# EAGLE schematic Arm Board (EAGLE 6.5.0)

## Sheet 1 of 8
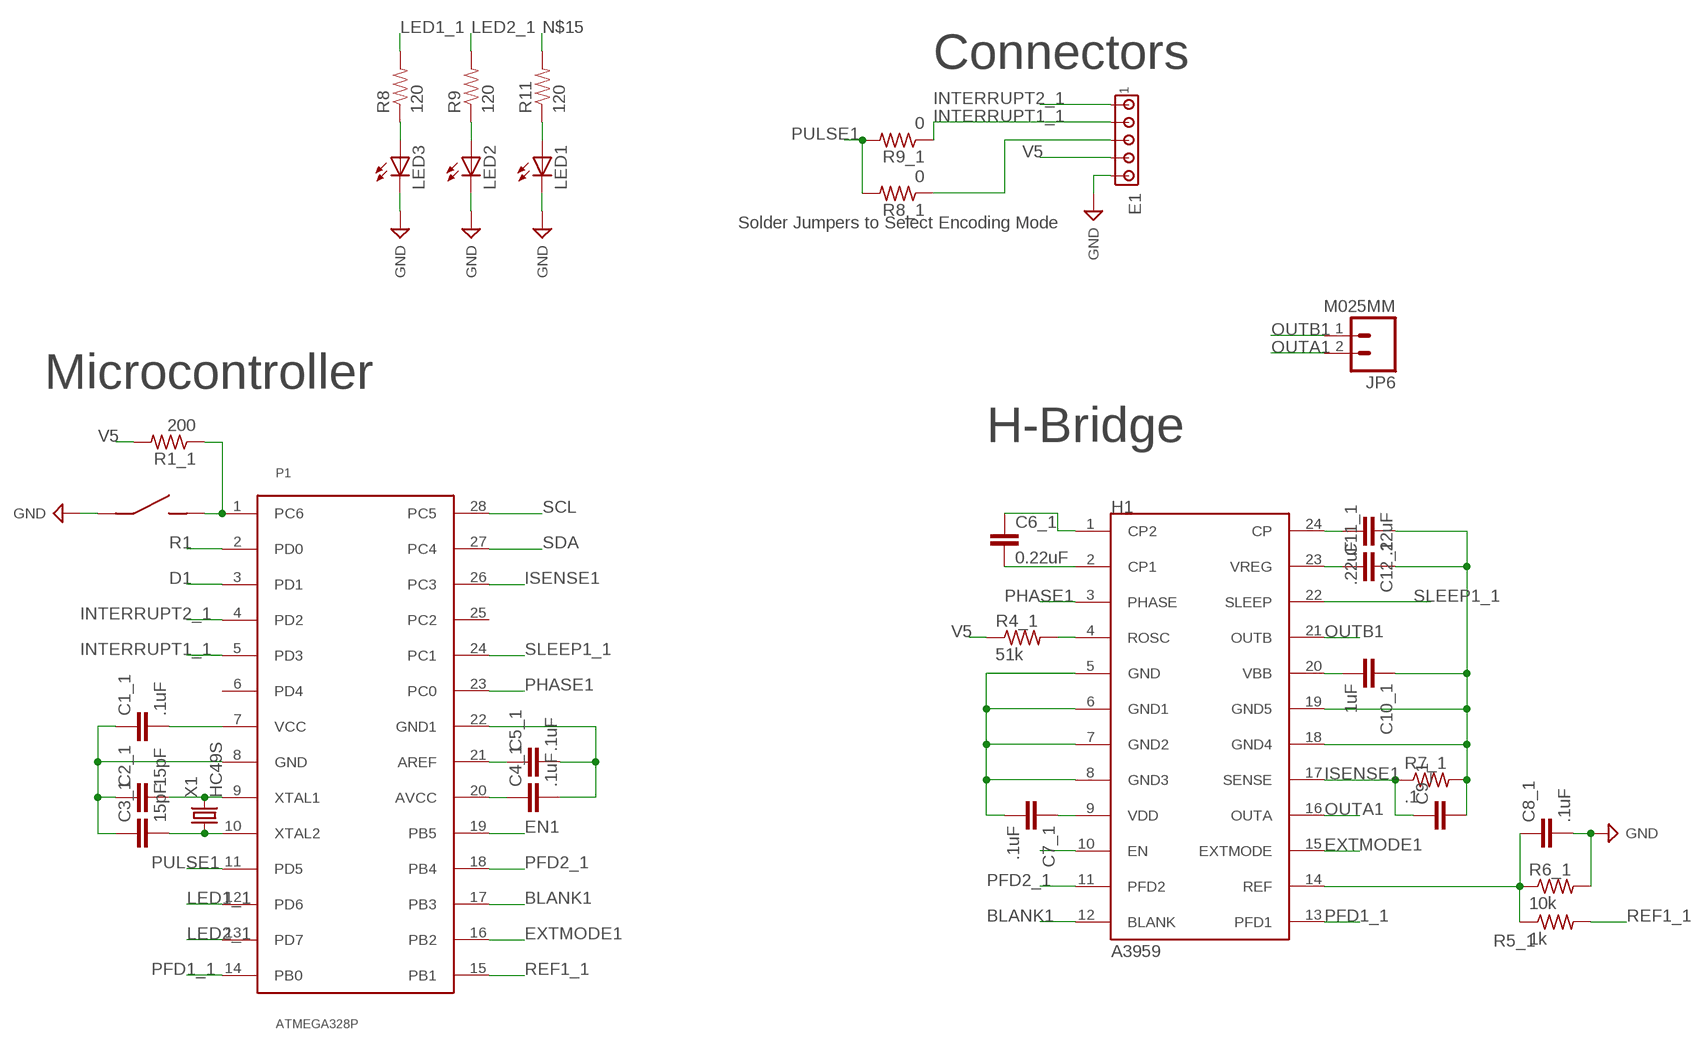
[diagram p0: schematic, sheet 1]

### Parts
C1_1  .1uF  C_CAP_0805  [C_0805]
C2_1  15pF  C_CAP_0805  [C_0805]
C3_1  15pF  C_CAP_0805  [C_0805]
C4_1  .1uF  C_CAP_0805  [C_0805]
C5_1  .1uF  C_CAP_0805  [C_0805]
C6_1  0.22uF  C_CAP_0805  [C_0805]
C7_1  .1uF  C_CAP_0805  [C_0805]
C8_1  .1uF  C_CAP_0805  [C_0805]
C9_1  C_CAP_0805  [C_0805]
C10_1  1uF  C_CAP_0805  [C_0805]
C11_1  .22uF  C_CAP_0805  [C_0805]
C12_1  .22uF  C_CAP_0805  [C_0805]
E1  J_MTA5P_100  [J_MTA100_5P]
H1  A3959  Q_A3959  [DIP24]
JP6  M025MM  [SCREWTERMINAL-5MM-2]
LED1  LED1206  [LED-1206]
LED2  LED1206  [LED-1206]
LED3  LED1206  [LED-1206]
P1  ATMEGA328P  Q_ATMEGA328P  [DIP28]
R1_1  200  R_RES_0805  [R_0805]
R4_1  51k  R_RES_0805  [R_0805]
R5_1  1k  R_RES_0805  [R_0805]
R6_1  10k  R_RES_0805  [R_0805]
R7_1  .1  R_RES_2010  [R_2010]
R8  120  RESISTOR1206  [1206]
R8_1  0  R_RES_0603  [R_0603]
R9  120  RESISTOR1206  [1206]
R9_1  0  R_RES_0603  [R_0603]
R11  120  RESISTOR1206  [1206]
S1  J_MC32857  [J_TOGGLE]
X1  HC49S  X_HC49SCRYSTAL  [HC-49]

### Nets
BLANK1: H1.12(BLANK) P1.17(PB3)
D1: P1.3(PD1)
EN1: H1.10(EN) P1.19(PB5)
EXTMODE1: H1.15(EXTMODE) P1.16(PB2)
GND: C1_1.1 C2_1.1 C3_1.1 C4_1.2 C5_1.2 C7_1.2 C8_1.2 C9_1.2 C10_1.1 C11_1.2 C12_1.1 E1.5 H1.5(GND) H1.6(GND1) H1.7(GND2) H1.8(GND3) H1.18(GND4) H1.19(GND5) LED1.C LED2.C LED3.C P1.8(GND) P1.22(GND1) R6_1.2 R7_1.2 S1.P$1 ; supply symbol labelled SUP_GND ; also sheet 2,3,4,5,6,7,8
INTERRUPT1_1: E1.2 P1.5(PD3) R9_1.1
INTERRUPT2_1: E1.1 P1.4(PD2)
ISENSE1: C9_1.1 H1.17(SENSE) P1.26(PC3) R7_1.1
LED1_1: P1.12(PD6) R8.2
LED2_1: P1.13(PD7) R9.2
N$3: LED3.A R8.1
N$4: LED2.A R9.1
N$6: LED1.A R11.1
N$11: C3_1.2 P1.10(XTAL2) X1.P$1
N$12: C2_1.2 P1.9(XTAL1) X1.P$2
N$14: C5_1.1 P1.21(AREF)
N$15: P1.1(PC6) R1_1.1 R11.2 S1.P$2
N$16: C6_1.1 H1.1(CP2)
N$17: C6_1.2 H1.2(CP1)
N$18: H1.4(ROSC) R4_1.2
N$20: C12_1.2 H1.24(CP)
N$22: C11_1.1 H1.23(VREG)
N$26: E1.3 R8_1.1
OUTA1: H1.16(OUTA) JP6.2
OUTB1: H1.21(OUTB) JP6.1
PFD1_1: H1.13(PFD1) P1.14(PB0)
PFD2_1: H1.11(PFD2) P1.18(PB4)
PHASE1: H1.3(PHASE) P1.23(PC0)
PULSE1: P1.11(PD5) R8_1.2 R9_1.2
R1: P1.2(PD0)
REF1: C8_1.1 H1.14(REF) R5_1.1 R6_1.1
REF1_1: P1.15(PB1) R5_1.2
SCL: P1.28(PC5) ; also sheet 2,3,4,5,6,7
SDA: P1.27(PC4) ; also sheet 2,3,4,5,6,7
SLEEP1_1: H1.22(SLEEP) P1.24(PC1)
V5: C1_1.2 C4_1.1 C7_1.1 E1.4 H1.9(VDD) P1.7(VCC) P1.20(AVCC) R1_1.2 R4_1.1 ; also sheet 2,3,4,5,6,7,8
VIN: C10_1.2 H1.20(VBB) ; also sheet 2,3,4,5,6,7,8
Unconnected: P1.6(PD4) P1.25(PC2)

### Notes on the sheet
- Connectors
- Solder Jumpers to Select Encoding Mode
- Microcontroller
- H-Bridge

## Sheet 2 of 8
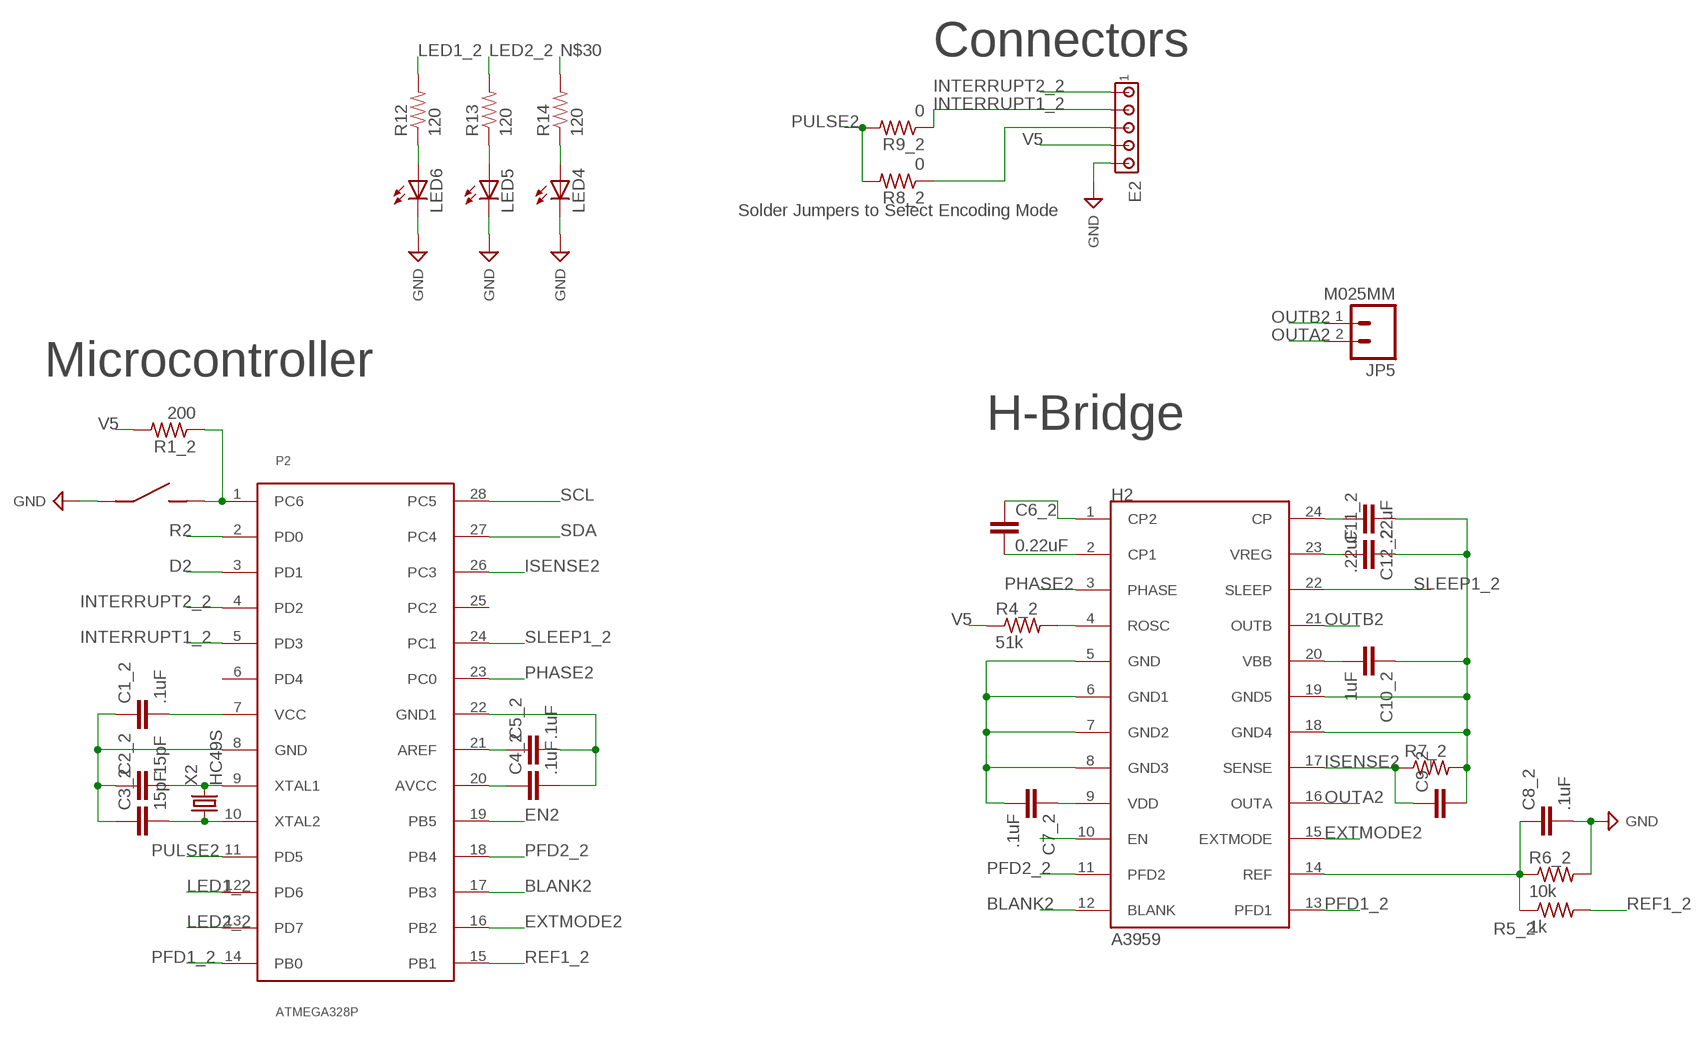
[diagram p1: schematic, sheet 2]

### Parts
C1_2  .1uF  C_CAP_0805  [C_0805]
C2_2  15pF  C_CAP_0805  [C_0805]
C3_2  15pF  C_CAP_0805  [C_0805]
C4_2  .1uF  C_CAP_0805  [C_0805]
C5_2  .1uF  C_CAP_0805  [C_0805]
C6_2  0.22uF  C_CAP_0805  [C_0805]
C7_2  .1uF  C_CAP_0805  [C_0805]
C8_2  .1uF  C_CAP_0805  [C_0805]
C9_2  C_CAP_0805  [C_0805]
C10_2  1uF  C_CAP_0805  [C_0805]
C11_2  .22uF  C_CAP_0805  [C_0805]
C12_2  .22uF  C_CAP_0805  [C_0805]
E2  J_MTA5P_100  [J_MTA100_5P]
H2  A3959  Q_A3959  [DIP24]
JP5  M025MM  [SCREWTERMINAL-5MM-2]
LED4  LED1206  [LED-1206]
LED5  LED1206  [LED-1206]
LED6  LED1206  [LED-1206]
P2  ATMEGA328P  Q_ATMEGA328P  [DIP28]
R1_2  200  R_RES_0805  [R_0805]
R4_2  51k  R_RES_0805  [R_0805]
R5_2  1k  R_RES_0805  [R_0805]
R6_2  10k  R_RES_0805  [R_0805]
R7_2  R_RES_2010  [R_2010]
R8_2  0  R_RES_0603  [R_0603]
R9_2  0  R_RES_0603  [R_0603]
R12  120  RESISTOR1206  [1206]
R13  120  RESISTOR1206  [1206]
R14  120  RESISTOR1206  [1206]
S2  J_MC32857  [J_TOGGLE]
X2  HC49S  X_HC49SCRYSTAL  [HC-49]

### Nets
BLANK2: H2.12(BLANK) P2.17(PB3)
D2: P2.3(PD1)
EN2: H2.10(EN) P2.19(PB5)
EXTMODE2: H2.15(EXTMODE) P2.16(PB2)
GND: C1_2.1 C2_2.1 C3_2.1 C4_2.2 C5_2.2 C7_2.2 C8_2.2 C9_2.2 C10_2.1 C11_2.2 C12_2.1 E2.5 H2.5(GND) H2.6(GND1) H2.7(GND2) H2.8(GND3) H2.18(GND4) H2.19(GND5) LED4.C LED5.C LED6.C P2.8(GND) P2.22(GND1) R6_2.2 R7_2.2 S2.P$1 ; supply symbol labelled SUP_GND ; also sheet 1,3,4,5,6,7,8
INTERRUPT1_2: E2.2 P2.5(PD3) R9_2.1
INTERRUPT2_2: E2.1 P2.4(PD2)
ISENSE2: C9_2.1 H2.17(SENSE) P2.26(PC3) R7_2.1
LED1_2: P2.12(PD6) R12.2
LED2_2: P2.13(PD7) R13.2
N$7: LED6.A R12.1
N$13: LED5.A R13.1
N$19: LED4.A R14.1
N$27: C3_2.2 P2.10(XTAL2) X2.P$1
N$28: C2_2.2 P2.9(XTAL1) X2.P$2
N$29: C5_2.1 P2.21(AREF)
N$30: P2.1(PC6) R1_2.1 R14.2 S2.P$2
N$31: C6_2.1 H2.1(CP2)
N$32: C6_2.2 H2.2(CP1)
N$33: H2.4(ROSC) R4_2.2
N$34: C12_2.2 H2.24(CP)
N$35: C11_2.1 H2.23(VREG)
N$39: E2.3 R8_2.1
OUTA2: H2.16(OUTA) JP5.2
OUTB2: H2.21(OUTB) JP5.1
PFD1_2: H2.13(PFD1) P2.14(PB0)
PFD2_2: H2.11(PFD2) P2.18(PB4)
PHASE2: H2.3(PHASE) P2.23(PC0)
PULSE2: P2.11(PD5) R8_2.2 R9_2.2
R2: P2.2(PD0)
REF1_2: P2.15(PB1) R5_2.2
REF2: C8_2.1 H2.14(REF) R5_2.1 R6_2.1
SCL: P2.28(PC5) ; also sheet 1,3,4,5,6,7
SDA: P2.27(PC4) ; also sheet 1,3,4,5,6,7
SLEEP1_2: H2.22(SLEEP) P2.24(PC1)
V5: C1_2.2 C4_2.1 C7_2.1 E2.4 H2.9(VDD) P2.7(VCC) P2.20(AVCC) R1_2.2 R4_2.1 ; also sheet 1,3,4,5,6,7,8
VIN: C10_2.2 H2.20(VBB) ; also sheet 1,3,4,5,6,7,8
Unconnected: P2.6(PD4) P2.25(PC2)

### Notes on the sheet
- Connectors
- Solder Jumpers to Select Encoding Mode
- Microcontroller
- H-Bridge

## Sheet 3 of 8
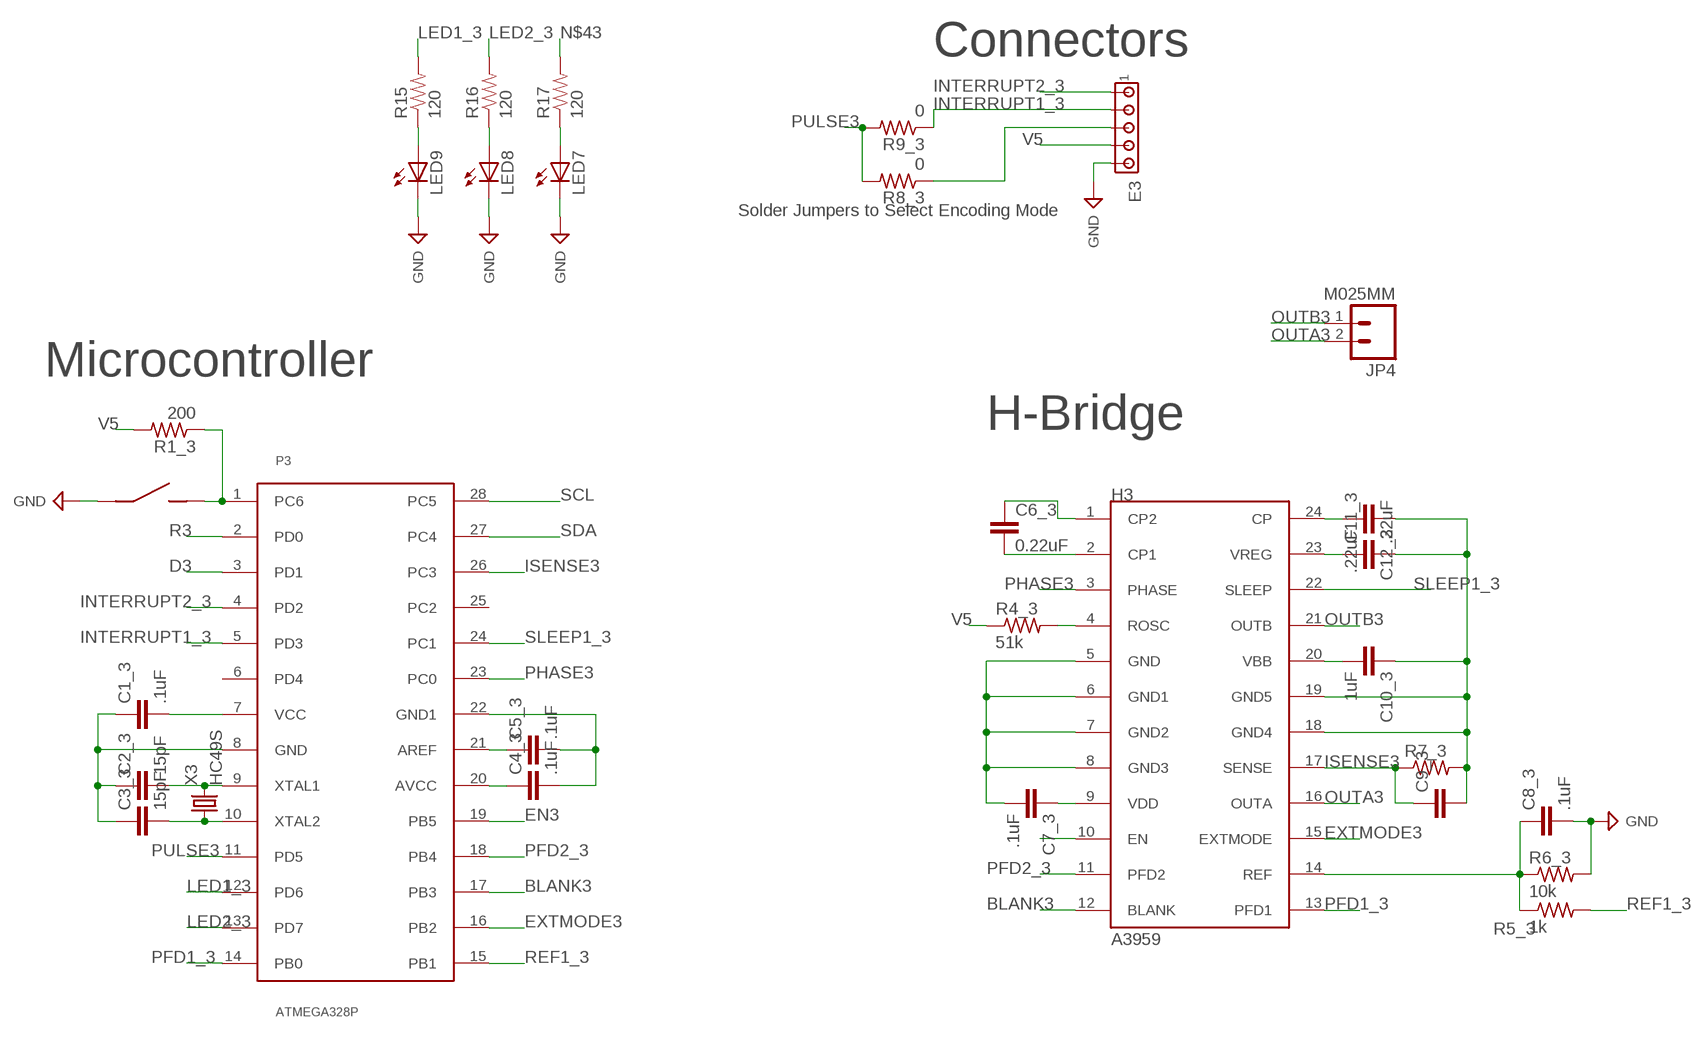
[diagram p2: schematic, sheet 3]

### Parts
C1_3  .1uF  C_CAP_0805  [C_0805]
C2_3  15pF  C_CAP_0805  [C_0805]
C3_3  15pF  C_CAP_0805  [C_0805]
C4_3  .1uF  C_CAP_0805  [C_0805]
C5_3  .1uF  C_CAP_0805  [C_0805]
C6_3  0.22uF  C_CAP_0805  [C_0805]
C7_3  .1uF  C_CAP_0805  [C_0805]
C8_3  .1uF  C_CAP_0805  [C_0805]
C9_3  C_CAP_0805  [C_0805]
C10_3  1uF  C_CAP_0805  [C_0805]
C11_3  .22uF  C_CAP_0805  [C_0805]
C12_3  .22uF  C_CAP_0805  [C_0805]
E3  J_MTA5P_100  [J_MTA100_5P]
H3  A3959  Q_A3959  [DIP24]
JP4  M025MM  [SCREWTERMINAL-5MM-2]
LED7  LED1206  [LED-1206]
LED8  LED1206  [LED-1206]
LED9  LED1206  [LED-1206]
P3  ATMEGA328P  Q_ATMEGA328P  [DIP28]
R1_3  200  R_RES_0805  [R_0805]
R4_3  51k  R_RES_0805  [R_0805]
R5_3  1k  R_RES_0805  [R_0805]
R6_3  10k  R_RES_0805  [R_0805]
R7_3  R_RES_2010  [R_2010]
R8_3  0  R_RES_0603  [R_0603]
R9_3  0  R_RES_0603  [R_0603]
R15  120  RESISTOR1206  [1206]
R16  120  RESISTOR1206  [1206]
R17  120  RESISTOR1206  [1206]
S3  J_MC32857  [J_TOGGLE]
X3  HC49S  X_HC49SCRYSTAL  [HC-49]

### Nets
BLANK3: H3.12(BLANK) P3.17(PB3)
D3: P3.3(PD1)
EN3: H3.10(EN) P3.19(PB5)
EXTMODE3: H3.15(EXTMODE) P3.16(PB2)
GND: C1_3.1 C2_3.1 C3_3.1 C4_3.2 C5_3.2 C7_3.2 C8_3.2 C9_3.2 C10_3.1 C11_3.2 C12_3.1 E3.5 H3.5(GND) H3.6(GND1) H3.7(GND2) H3.8(GND3) H3.18(GND4) H3.19(GND5) LED7.C LED8.C LED9.C P3.8(GND) P3.22(GND1) R6_3.2 R7_3.2 S3.P$1 ; supply symbol labelled SUP_GND ; also sheet 1,2,4,5,6,7,8
INTERRUPT1_3: E3.2 P3.5(PD3) R9_3.1
INTERRUPT2_3: E3.1 P3.4(PD2)
ISENSE3: C9_3.1 H3.17(SENSE) P3.26(PC3) R7_3.1
LED1_3: P3.12(PD6) R15.2
LED2_3: P3.13(PD7) R16.2
N$21: LED9.A R15.1
N$23: LED8.A R16.1
N$24: LED7.A R17.1
N$40: C3_3.2 P3.10(XTAL2) X3.P$1
N$41: C2_3.2 P3.9(XTAL1) X3.P$2
N$42: C5_3.1 P3.21(AREF)
N$43: P3.1(PC6) R1_3.1 R17.2 S3.P$2
N$44: C6_3.1 H3.1(CP2)
N$45: C6_3.2 H3.2(CP1)
N$46: H3.4(ROSC) R4_3.2
N$47: C12_3.2 H3.24(CP)
N$48: C11_3.1 H3.23(VREG)
N$52: E3.3 R8_3.1
OUTA3: H3.16(OUTA) JP4.2
OUTB3: H3.21(OUTB) JP4.1
PFD1_3: H3.13(PFD1) P3.14(PB0)
PFD2_3: H3.11(PFD2) P3.18(PB4)
PHASE3: H3.3(PHASE) P3.23(PC0)
PULSE3: P3.11(PD5) R8_3.2 R9_3.2
R3: P3.2(PD0)
REF1_3: P3.15(PB1) R5_3.2
REF3: C8_3.1 H3.14(REF) R5_3.1 R6_3.1
SCL: P3.28(PC5) ; also sheet 1,2,4,5,6,7
SDA: P3.27(PC4) ; also sheet 1,2,4,5,6,7
SLEEP1_3: H3.22(SLEEP) P3.24(PC1)
V5: C1_3.2 C4_3.1 C7_3.1 E3.4 H3.9(VDD) P3.7(VCC) P3.20(AVCC) R1_3.2 R4_3.1 ; also sheet 1,2,4,5,6,7,8
VIN: C10_3.2 H3.20(VBB) ; also sheet 1,2,4,5,6,7,8
Unconnected: P3.6(PD4) P3.25(PC2)

### Notes on the sheet
- Connectors
- Solder Jumpers to Select Encoding Mode
- Microcontroller
- H-Bridge

## Sheet 4 of 8
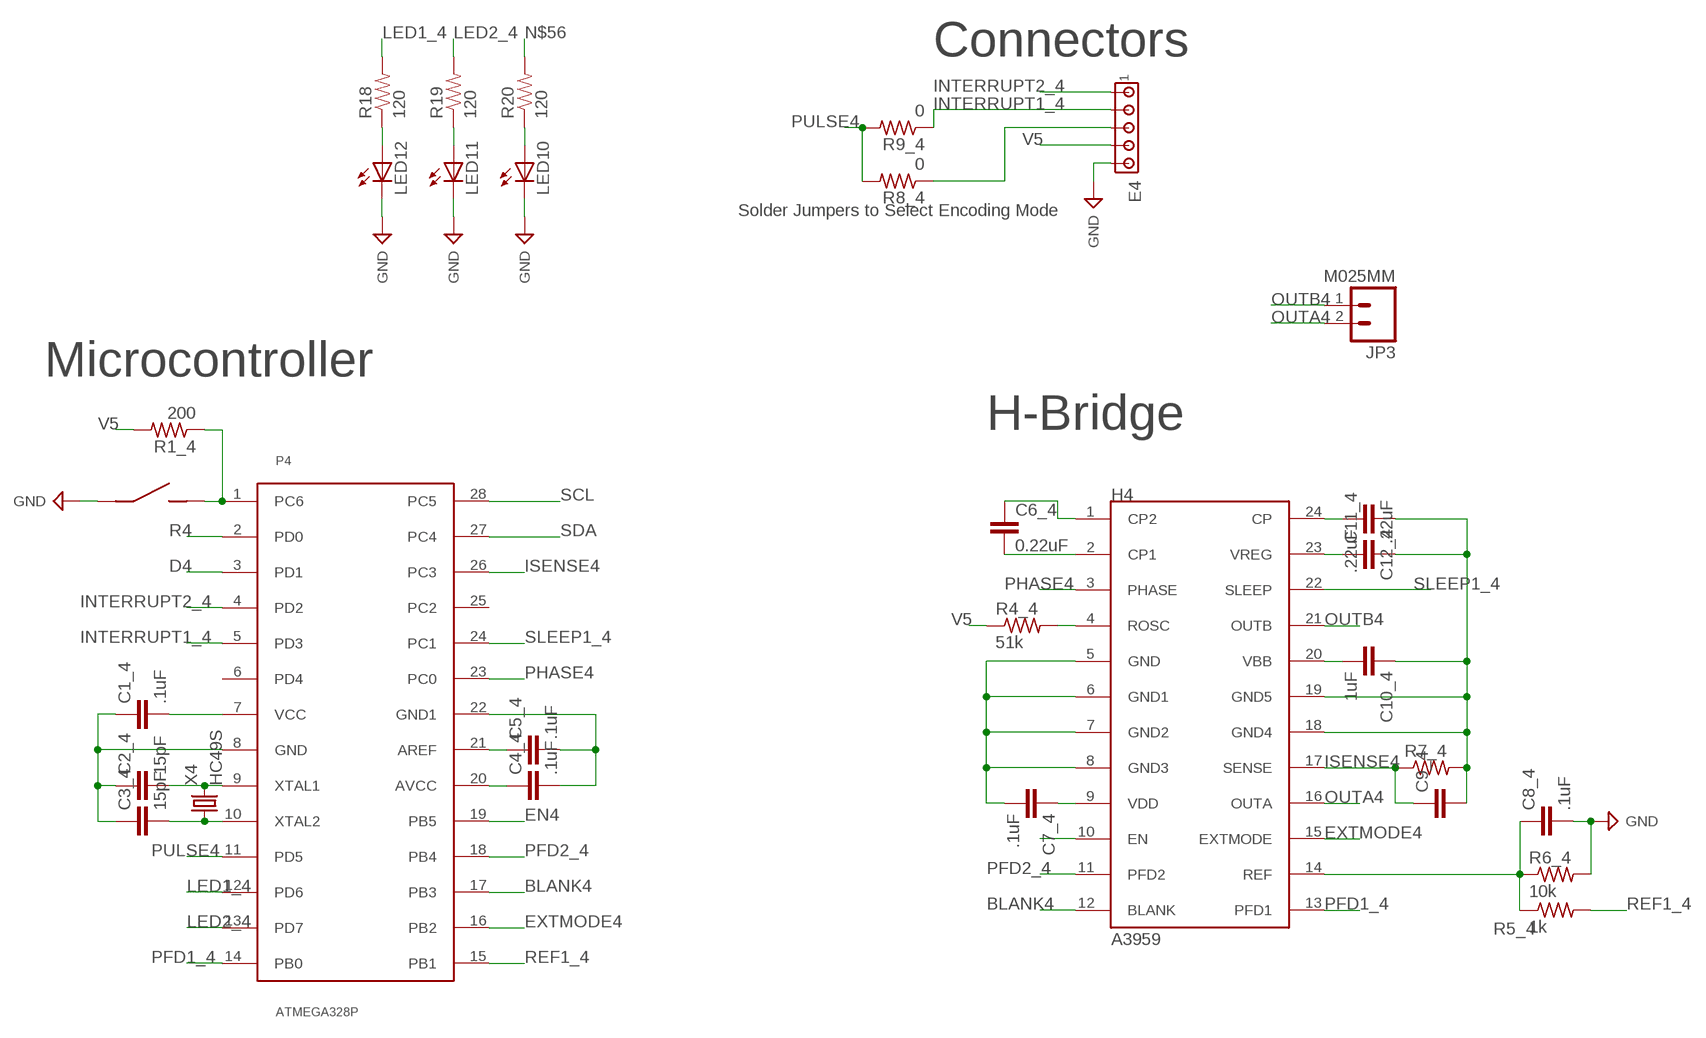
[diagram p3: schematic, sheet 4]

### Parts
C1_4  .1uF  C_CAP_0805  [C_0805]
C2_4  15pF  C_CAP_0805  [C_0805]
C3_4  15pF  C_CAP_0805  [C_0805]
C4_4  .1uF  C_CAP_0805  [C_0805]
C5_4  .1uF  C_CAP_0805  [C_0805]
C6_4  0.22uF  C_CAP_0805  [C_0805]
C7_4  .1uF  C_CAP_0805  [C_0805]
C8_4  .1uF  C_CAP_0805  [C_0805]
C9_4  C_CAP_0805  [C_0805]
C10_4  1uF  C_CAP_0805  [C_0805]
C11_4  .22uF  C_CAP_0805  [C_0805]
C12_4  .22uF  C_CAP_0805  [C_0805]
E4  J_MTA5P_100  [J_MTA100_5P]
H4  A3959  Q_A3959  [DIP24]
JP3  M025MM  [SCREWTERMINAL-5MM-2]
LED10  LED1206  [LED-1206]
LED11  LED1206  [LED-1206]
LED12  LED1206  [LED-1206]
P4  ATMEGA328P  Q_ATMEGA328P  [DIP28]
R1_4  200  R_RES_0805  [R_0805]
R4_4  51k  R_RES_0805  [R_0805]
R5_4  1k  R_RES_0805  [R_0805]
R6_4  10k  R_RES_0805  [R_0805]
R7_4  R_RES_2010  [R_2010]
R8_4  0  R_RES_0603  [R_0603]
R9_4  0  R_RES_0603  [R_0603]
R18  120  RESISTOR1206  [1206]
R19  120  RESISTOR1206  [1206]
R20  120  RESISTOR1206  [1206]
S4  J_MC32857  [J_TOGGLE]
X4  HC49S  X_HC49SCRYSTAL  [HC-49]

### Nets
BLANK4: H4.12(BLANK) P4.17(PB3)
D4: P4.3(PD1)
EN4: H4.10(EN) P4.19(PB5)
EXTMODE4: H4.15(EXTMODE) P4.16(PB2)
GND: C1_4.1 C2_4.1 C3_4.1 C4_4.2 C5_4.2 C7_4.2 C8_4.2 C9_4.2 C10_4.1 C11_4.2 C12_4.1 E4.5 H4.5(GND) H4.6(GND1) H4.7(GND2) H4.8(GND3) H4.18(GND4) H4.19(GND5) LED10.C LED11.C LED12.C P4.8(GND) P4.22(GND1) R6_4.2 R7_4.2 S4.P$1 ; supply symbol labelled SUP_GND ; also sheet 1,2,3,5,6,7,8
INTERRUPT1_4: E4.2 P4.5(PD3) R9_4.1
INTERRUPT2_4: E4.1 P4.4(PD2)
ISENSE4: C9_4.1 H4.17(SENSE) P4.26(PC3) R7_4.1
LED1_4: P4.12(PD6) R18.2
LED2_4: P4.13(PD7) R19.2
N$25: LED12.A R18.1
N$36: LED11.A R19.1
N$37: LED10.A R20.1
N$53: C3_4.2 P4.10(XTAL2) X4.P$1
N$54: C2_4.2 P4.9(XTAL1) X4.P$2
N$55: C5_4.1 P4.21(AREF)
N$56: P4.1(PC6) R1_4.1 R20.2 S4.P$2
N$57: C6_4.1 H4.1(CP2)
N$58: C6_4.2 H4.2(CP1)
N$59: H4.4(ROSC) R4_4.2
N$60: C12_4.2 H4.24(CP)
N$61: C11_4.1 H4.23(VREG)
N$65: E4.3 R8_4.1
OUTA4: H4.16(OUTA) JP3.2
OUTB4: H4.21(OUTB) JP3.1
PFD1_4: H4.13(PFD1) P4.14(PB0)
PFD2_4: H4.11(PFD2) P4.18(PB4)
PHASE4: H4.3(PHASE) P4.23(PC0)
PULSE4: P4.11(PD5) R8_4.2 R9_4.2
R4: P4.2(PD0)
REF1_4: P4.15(PB1) R5_4.2
REF4: C8_4.1 H4.14(REF) R5_4.1 R6_4.1
SCL: P4.28(PC5) ; also sheet 1,2,3,5,6,7
SDA: P4.27(PC4) ; also sheet 1,2,3,5,6,7
SLEEP1_4: H4.22(SLEEP) P4.24(PC1)
V5: C1_4.2 C4_4.1 C7_4.1 E4.4 H4.9(VDD) P4.7(VCC) P4.20(AVCC) R1_4.2 R4_4.1 ; also sheet 1,2,3,5,6,7,8
VIN: C10_4.2 H4.20(VBB) ; also sheet 1,2,3,5,6,7,8
Unconnected: P4.6(PD4) P4.25(PC2)

### Notes on the sheet
- Connectors
- Solder Jumpers to Select Encoding Mode
- Microcontroller
- H-Bridge

## Sheet 5 of 8
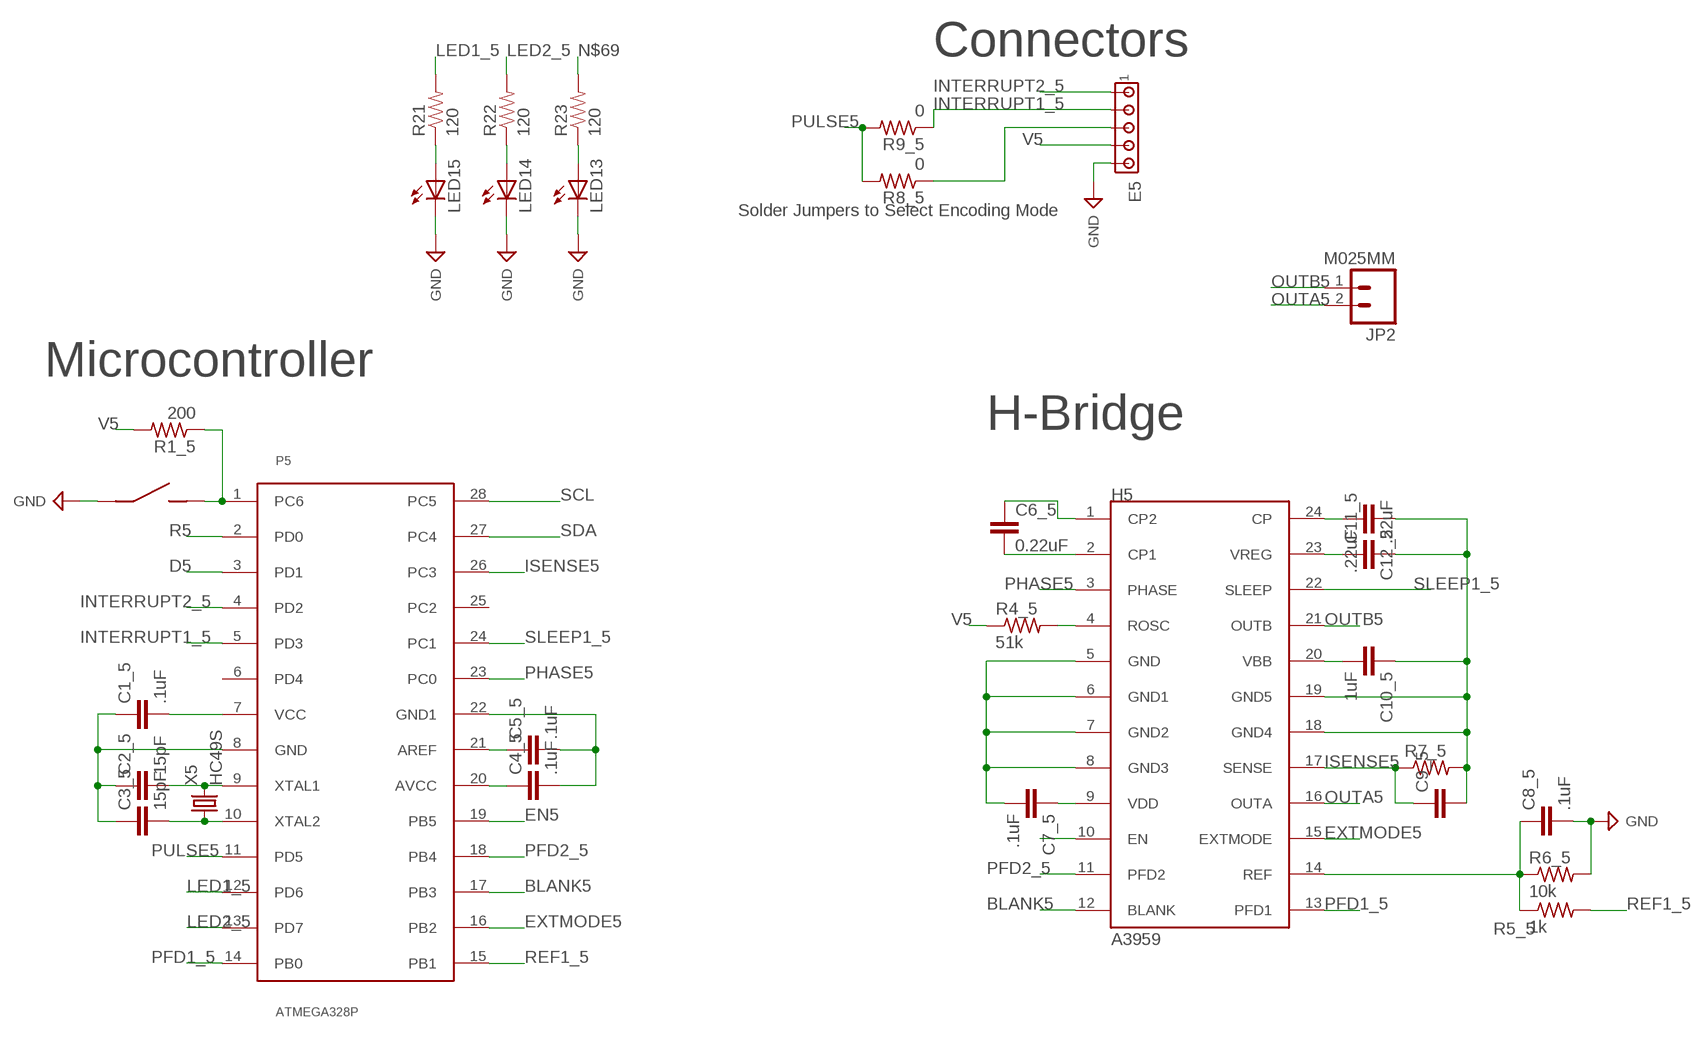
[diagram p4: schematic, sheet 5]

### Parts
C1_5  .1uF  C_CAP_0805  [C_0805]
C2_5  15pF  C_CAP_0805  [C_0805]
C3_5  15pF  C_CAP_0805  [C_0805]
C4_5  .1uF  C_CAP_0805  [C_0805]
C5_5  .1uF  C_CAP_0805  [C_0805]
C6_5  0.22uF  C_CAP_0805  [C_0805]
C7_5  .1uF  C_CAP_0805  [C_0805]
C8_5  .1uF  C_CAP_0805  [C_0805]
C9_5  C_CAP_0805  [C_0805]
C10_5  1uF  C_CAP_0805  [C_0805]
C11_5  .22uF  C_CAP_0805  [C_0805]
C12_5  .22uF  C_CAP_0805  [C_0805]
E5  J_MTA5P_100  [J_MTA100_5P]
H5  A3959  Q_A3959  [DIP24]
JP2  M025MM  [SCREWTERMINAL-5MM-2]
LED13  LED1206  [LED-1206]
LED14  LED1206  [LED-1206]
LED15  LED1206  [LED-1206]
P5  ATMEGA328P  Q_ATMEGA328P  [DIP28]
R1_5  200  R_RES_0805  [R_0805]
R4_5  51k  R_RES_0805  [R_0805]
R5_5  1k  R_RES_0805  [R_0805]
R6_5  10k  R_RES_0805  [R_0805]
R7_5  R_RES_2010  [R_2010]
R8_5  0  R_RES_0603  [R_0603]
R9_5  0  R_RES_0603  [R_0603]
R21  120  RESISTOR1206  [1206]
R22  120  RESISTOR1206  [1206]
R23  120  RESISTOR1206  [1206]
S5  J_MC32857  [J_TOGGLE]
X5  HC49S  X_HC49SCRYSTAL  [HC-49]

### Nets
BLANK5: H5.12(BLANK) P5.17(PB3)
D5: P5.3(PD1)
EN5: H5.10(EN) P5.19(PB5)
EXTMODE5: H5.15(EXTMODE) P5.16(PB2)
GND: C1_5.1 C2_5.1 C3_5.1 C4_5.2 C5_5.2 C7_5.2 C8_5.2 C9_5.2 C10_5.1 C11_5.2 C12_5.1 E5.5 H5.5(GND) H5.6(GND1) H5.7(GND2) H5.8(GND3) H5.18(GND4) H5.19(GND5) LED13.C LED14.C LED15.C P5.8(GND) P5.22(GND1) R6_5.2 R7_5.2 S5.P$1 ; supply symbol labelled SUP_GND ; also sheet 1,2,3,4,6,7,8
INTERRUPT1_5: E5.2 P5.5(PD3) R9_5.1
INTERRUPT2_5: E5.1 P5.4(PD2)
ISENSE5: C9_5.1 H5.17(SENSE) P5.26(PC3) R7_5.1
LED1_5: P5.12(PD6) R21.2
LED2_5: P5.13(PD7) R22.2
N$38: LED15.A R21.1
N$49: LED14.A R22.1
N$50: LED13.A R23.1
N$66: C3_5.2 P5.10(XTAL2) X5.P$1
N$67: C2_5.2 P5.9(XTAL1) X5.P$2
N$68: C5_5.1 P5.21(AREF)
N$69: P5.1(PC6) R1_5.1 R23.2 S5.P$2
N$70: C6_5.1 H5.1(CP2)
N$71: C6_5.2 H5.2(CP1)
N$72: H5.4(ROSC) R4_5.2
N$73: C12_5.2 H5.24(CP)
N$74: C11_5.1 H5.23(VREG)
N$78: E5.3 R8_5.1
OUTA5: H5.16(OUTA) JP2.2
OUTB5: H5.21(OUTB) JP2.1
PFD1_5: H5.13(PFD1) P5.14(PB0)
PFD2_5: H5.11(PFD2) P5.18(PB4)
PHASE5: H5.3(PHASE) P5.23(PC0)
PULSE5: P5.11(PD5) R8_5.2 R9_5.2
R5: P5.2(PD0)
REF1_5: P5.15(PB1) R5_5.2
REF5: C8_5.1 H5.14(REF) R5_5.1 R6_5.1
SCL: P5.28(PC5) ; also sheet 1,2,3,4,6,7
SDA: P5.27(PC4) ; also sheet 1,2,3,4,6,7
SLEEP1_5: H5.22(SLEEP) P5.24(PC1)
V5: C1_5.2 C4_5.1 C7_5.1 E5.4 H5.9(VDD) P5.7(VCC) P5.20(AVCC) R1_5.2 R4_5.1 ; also sheet 1,2,3,4,6,7,8
VIN: C10_5.2 H5.20(VBB) ; also sheet 1,2,3,4,6,7,8
Unconnected: P5.6(PD4) P5.25(PC2)

### Notes on the sheet
- Connectors
- Solder Jumpers to Select Encoding Mode
- Microcontroller
- H-Bridge

## Sheet 6 of 8
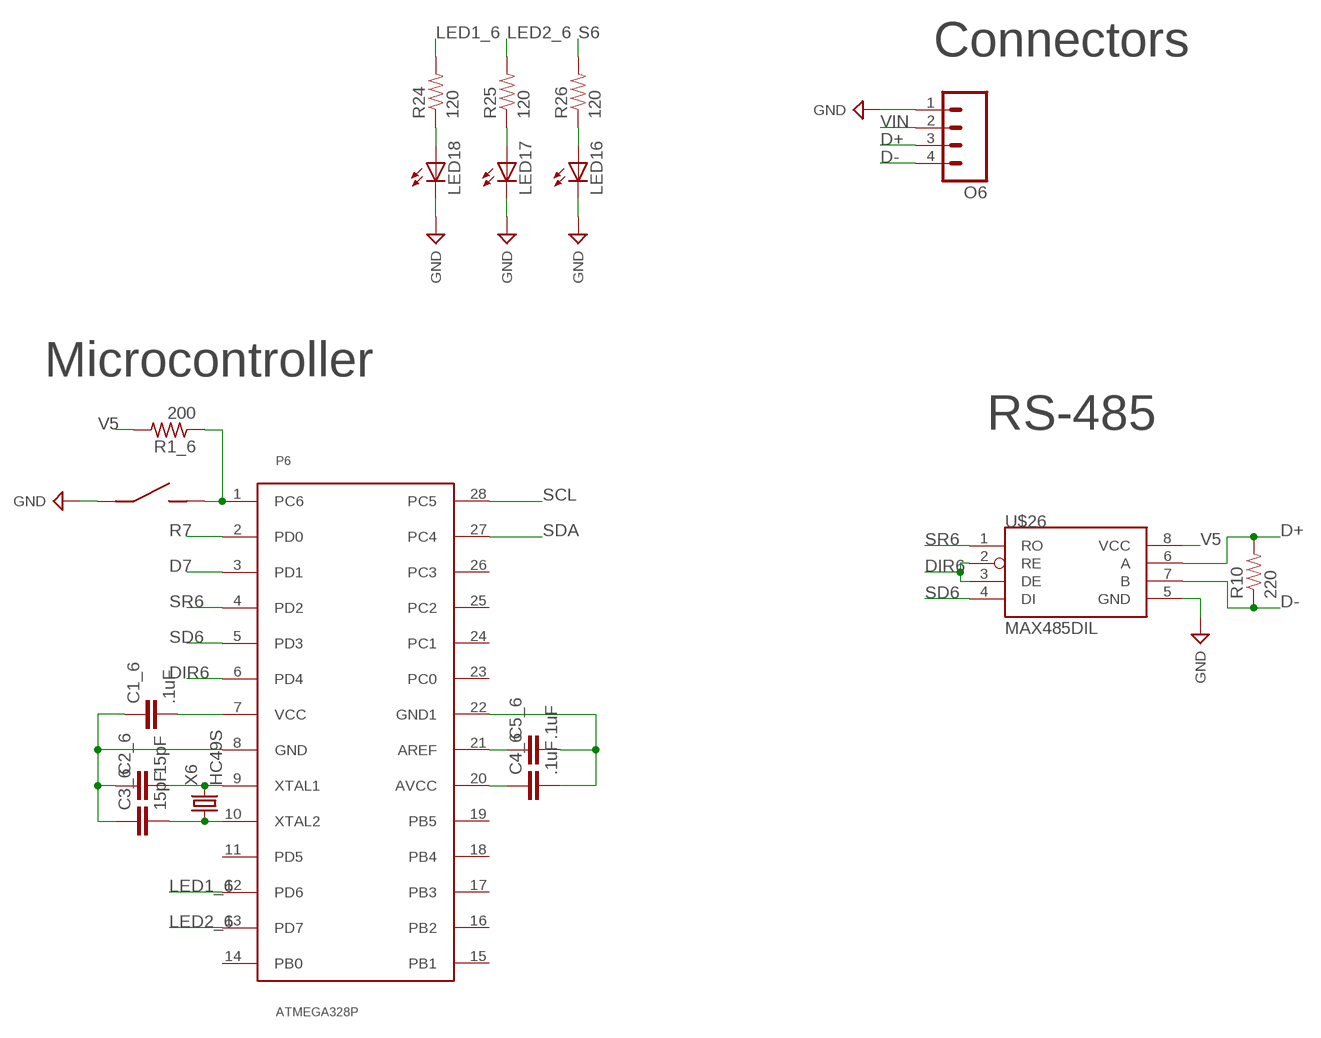
[diagram p5: schematic, sheet 6]

### Parts
C1_6  .1uF  C_CAP_0805  [C_0805]
C2_6  15pF  C_CAP_0805  [C_0805]
C3_6  15pF  C_CAP_0805  [C_0805]
C4_6  .1uF  C_CAP_0805  [C_0805]
C5_6  .1uF  C_CAP_0805  [C_0805]
J6  J_MC32857  [J_TOGGLE]
LED16  LED1206  [LED-1206]
LED17  LED1206  [LED-1206]
LED18  LED1206  [LED-1206]
O6  M041X04_NO_SILK  [1X04_NO_SILK]
P6  ATMEGA328P  Q_ATMEGA328P  [DIP28]
R1_6  200  R_RES_0805  [R_0805]
R10  220  RESISTOREZ  [AXIAL-0.3EZ]
R24  120  RESISTOR1206  [1206]
R25  120  RESISTOR1206  [1206]
R26  120  RESISTOR1206  [1206]
U$26  MAX485DIL  [DIL08]
X6  HC49S  X_HC49SCRYSTAL  [HC-49]

### Nets
D7: P6.3(PD1)
D+: O6.3 R10.P$2 U$26.6(A)
D-: O6.4 R10.P$1 U$26.7(B)
DIR6: P6.6(PD4) U$26.2(RE) U$26.3(DE)
GND: C1_6.1 C2_6.1 C3_6.1 C4_6.2 C5_6.2 J6.P$1 LED16.C LED17.C LED18.C O6.1 P6.8(GND) P6.22(GND1) U$26.5(GND) ; supply symbol labelled SUP_GND ; also sheet 1,2,3,4,5,7,8
LED1_6: P6.12(PD6) R24.2
LED2_6: P6.13(PD7) R25.2
N$51: LED18.A R24.1
N$62: LED17.A R25.1
N$63: LED16.A R26.1
N$79: C3_6.2 P6.10(XTAL2) X6.P$1
N$80: C2_6.2 P6.9(XTAL1) X6.P$2
N$81: C5_6.1 P6.21(AREF)
R7: P6.2(PD0)
S6: J6.P$2 P6.1(PC6) R1_6.1 R26.2
SCL: P6.28(PC5) ; also sheet 1,2,3,4,5,7
SD6: P6.5(PD3) U$26.4(DI)
SDA: P6.27(PC4) ; also sheet 1,2,3,4,5,7
SR6: P6.4(PD2) U$26.1(RO)
V5: C1_6.2 C4_6.1 P6.7(VCC) P6.20(AVCC) R1_6.2 U$26.8(VCC) ; also sheet 1,2,3,4,5,7,8
VIN: O6.2 ; also sheet 1,2,3,4,5,7,8
Unconnected: P6.11(PD5) P6.14(PB0) P6.15(PB1) P6.16(PB2) P6.17(PB3) P6.18(PB4) P6.19(PB5) P6.23(PC0) P6.24(PC1) P6.25(PC2) P6.26(PC3)

### Notes on the sheet
- Connectors
- Microcontroller
- RS-485

## Sheet 7 of 8
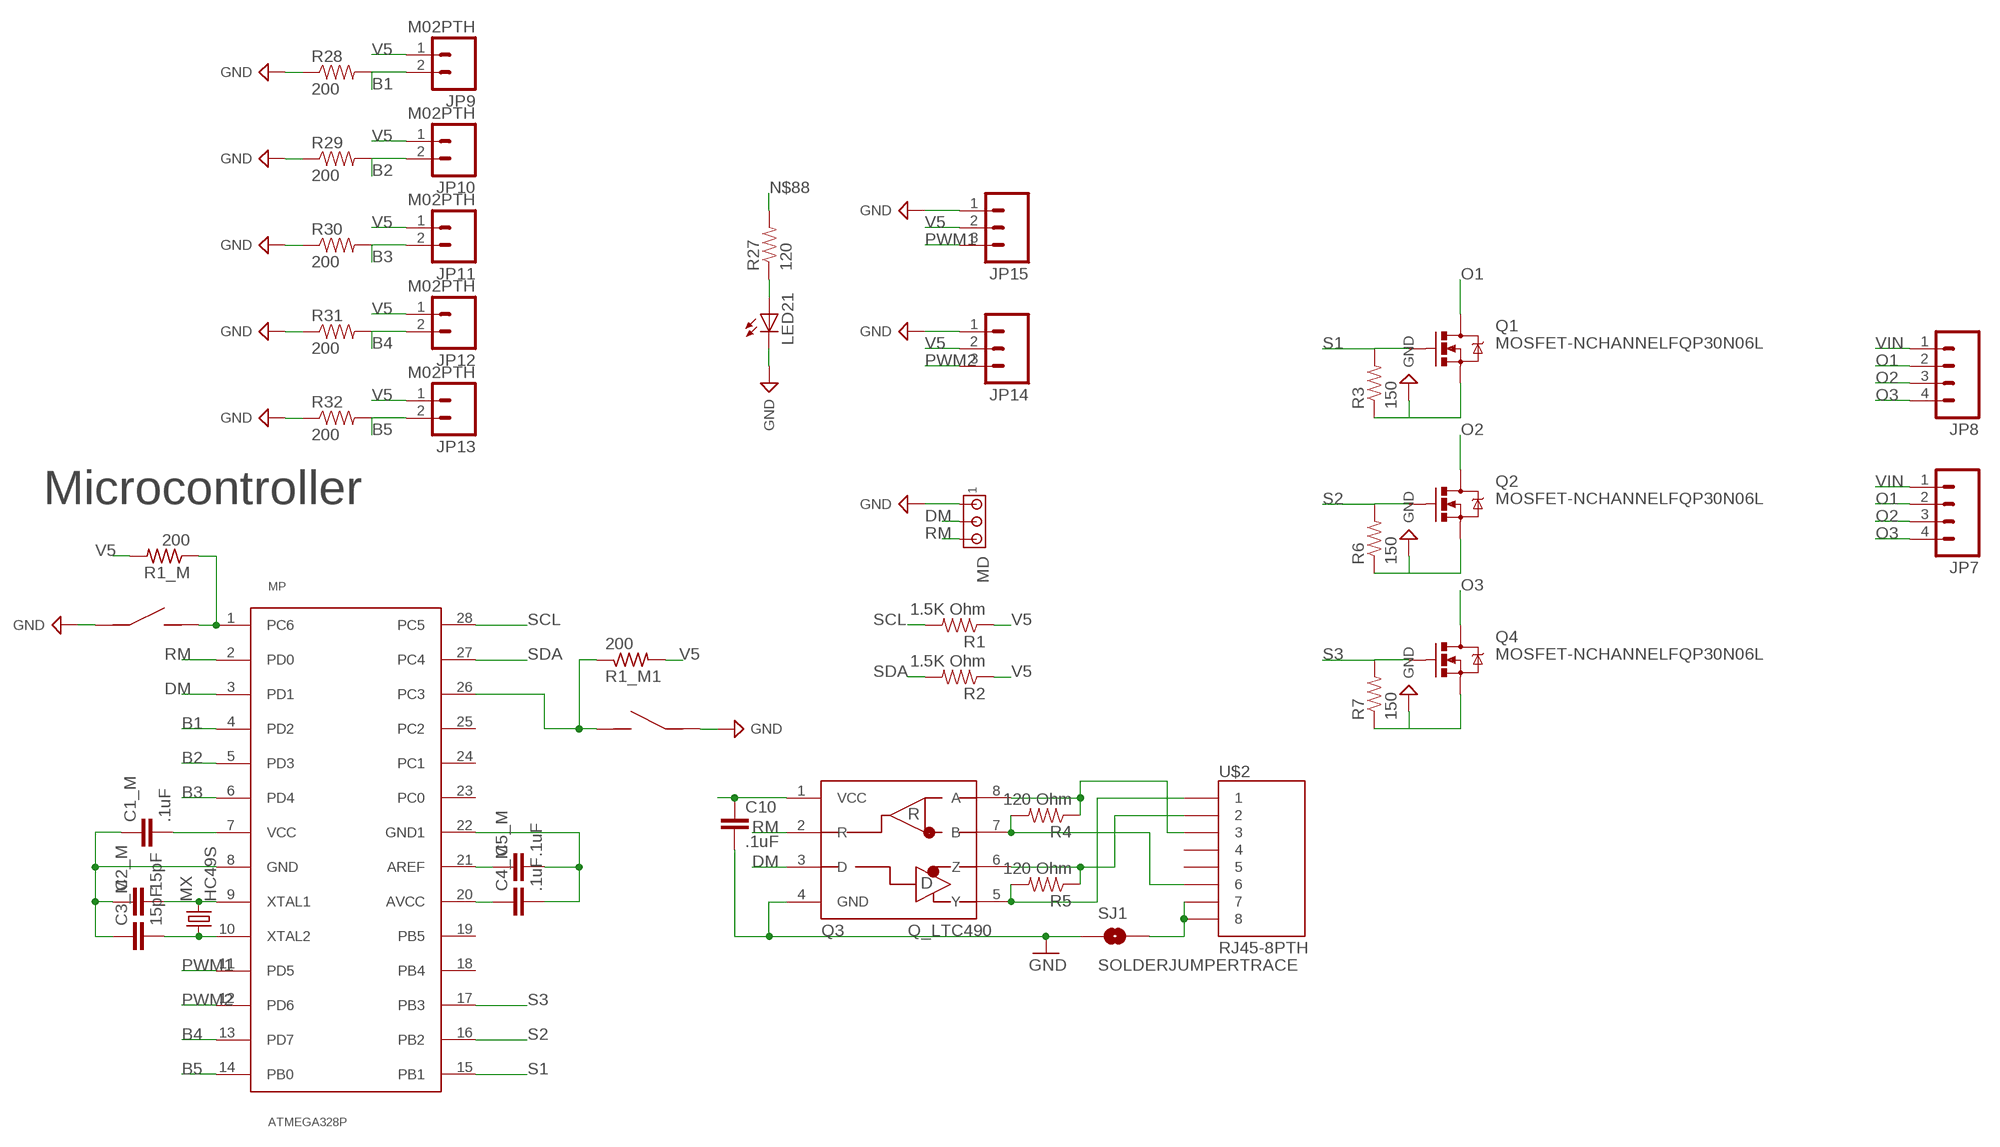
[diagram p6: schematic, sheet 7]

### Parts
C1_M  .1uF  C_CAP_0805  [C_0805]
C2_M  15pF  C_CAP_0805  [C_0805]
C3_M  15pF  C_CAP_0805  [C_0805]
C4_M  .1uF  C_CAP_0805  [C_0805]
C5_M  .1uF  C_CAP_0805  [C_0805]
C10  .1uF  CAPKIT  [CAP-PTH-SMALL-KIT]
JP7  M041X04_NO_SILK  [1X04_NO_SILK]
JP8  M041X04_NO_SILK  [1X04_NO_SILK]
JP9  M02PTH  [1X02]
JP10  M02PTH  [1X02]
JP11  M02PTH  [1X02]
JP12  M02PTH  [1X02]
JP13  M02PTH  [1X02]
JP14  M03PTH  [1X03]
JP15  M03PTH  [1X03]
LED21  LED1206  [LED-1206]
MD  J_MTA3P_100  [J_MTA100_3P]
MP  ATMEGA328P  Q_ATMEGA328P  [DIP28]
MS  J_MC32857  [J_TOGGLE]
MS1  J_MC32857  [J_TOGGLE]
MX  HC49S  X_HC49SCRYSTAL  [HC-49]
Q1  MOSFET-NCHANNELFQP30N06L  [TO220V]
Q2  MOSFET-NCHANNELFQP30N06L  [TO220V]
Q3  Q_LTC490  [DIP8]
Q4  MOSFET-NCHANNELFQP30N06L  [TO220V]
R1  1.5K Ohm  RESISTORAXIAL-0.3  [AXIAL-0.3]
R1_M  200  R_RES_0805  [R_0805]
R1_M1  200  R_RES_0805  [R_0805]
R2  1.5K Ohm  RESISTORAXIAL-0.3  [AXIAL-0.3]
R3  150  10KOHM1/6W5%(PTH)KIT  [AXIAL-0.3-KIT]
R4  120 Ohm  RESISTORAXIAL-0.3  [AXIAL-0.3]
R5  120 Ohm  RESISTORAXIAL-0.3  [AXIAL-0.3]
R6  150  10KOHM1/6W5%(PTH)KIT  [AXIAL-0.3-KIT]
R7  150  10KOHM1/6W5%(PTH)KIT  [AXIAL-0.3-KIT]
R27  120  RESISTOR1206  [1206]
R28  200  RESISTORPTH-1/6W  [1/6W-RES]
R29  200  RESISTORPTH-1/6W  [1/6W-RES]
R30  200  RESISTORPTH-1/6W  [1/6W-RES]
R31  200  RESISTORPTH-1/6W  [1/6W-RES]
R32  200  RESISTORPTH-1/6W  [1/6W-RES]
SJ1  SOLDERJUMPERTRACE  [SJ_2S-TRACE]
U$2  RJ45-8PTH  [RJ45-8]

### Nets
B1: JP9.2 MP.4(PD2) R28.2
B2: JP10.2 MP.5(PD3) R29.2
B3: JP11.2 MP.6(PD4) R30.2
B4: JP12.2 MP.13(PD7) R31.2
B5: JP13.2 MP.14(PB0) R32.2
DM: MD.2 MP.3(PD1) Q3.3(D)
GND: C1_M.1 C2_M.1 C3_M.1 C4_M.2 C5_M.2 C10.2 JP14.1 JP15.1 LED21.C MD.1 MP.8(GND) MP.22(GND1) MS1.P$1 MS.P$1 Q1.3(S) Q2.3(S) Q3.4(GND) Q4.3(S) R3.P$1 R6.P$1 R7.P$1 R28.1 R29.1 R30.1 R31.1 R32.1 SJ1.1 ; supply symbol labelled SUP_GND ; also sheet 1,2,3,4,5,6,8
N$2: Q3.8(A) R4.P$1 U$2.3
N$5: Q3.5(Y) R5.P$2 U$2.1
N$8: SJ1.2 U$2.7 U$2.8
N$9: Q3.6(Z) R5.P$1 U$2.2
N$10: Q3.7(B) R4.P$2 U$2.6
N$64: LED21.A R27.1
N$75: MP.26(PC3) MS1.P$2 R1_M1.1
N$85: C3_M.2 MP.10(XTAL2) MX.P$1
N$86: C2_M.2 MP.9(XTAL1) MX.P$2
N$87: C5_M.1 MP.21(AREF)
N$88: MP.1(PC6) MS.P$2 R1_M.1 R27.2
O1: JP7.2 JP8.2 Q1.2(D)
O2: JP7.3 JP8.3 Q2.2(D)
O3: JP7.4 JP8.4 Q4.2(D)
PWM1: JP15.3 MP.11(PD5)
PWM2: JP14.3 MP.12(PD6)
RM: MD.3 MP.2(PD0) Q3.2(R)
S1: MP.15(PB1) Q1.1(G) R3.P$2
S2: MP.16(PB2) Q2.1(G) R6.P$2
S3: MP.17(PB3) Q4.1(G) R7.P$2
SCL: MP.28(PC5) R1.P$2 ; also sheet 1,2,3,4,5,6
SDA: MP.27(PC4) R2.P$2 ; also sheet 1,2,3,4,5,6
V5: C1_M.2 C4_M.1 C10.1 JP9.1 JP10.1 JP11.1 JP12.1 JP13.1 JP14.2 JP15.2 MP.7(VCC) MP.20(AVCC) Q3.1(VCC) R1.P$1 R1_M1.2 R1_M.2 R2.P$1 ; also sheet 1,2,3,4,5,6,8
VIN: JP7.1 JP8.1 ; also sheet 1,2,3,4,5,6,8
Unconnected: MP.18(PB4) MP.19(PB5) MP.23(PC0) MP.24(PC1) MP.25(PC2) U$2.4 U$2.5

### Notes on the sheet
- Microcontroller

## Sheet 8 of 8
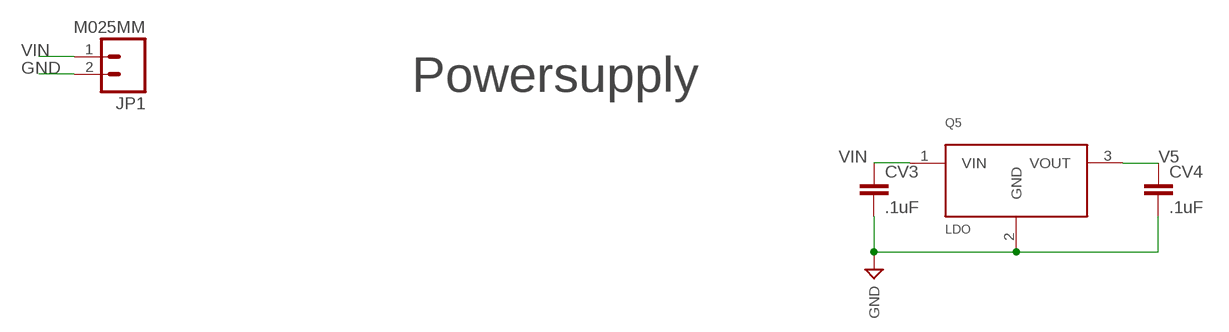
[diagram p7: schematic, sheet 8]

### Parts
CV3  .1uF  C_CAP_0805  [C_0805]
CV4  .1uF  C_CAP_0805  [C_0805]
JP1  M025MM  [SCREWTERMINAL-5MM-2]
Q5  LDO  Q_LDO  [TO-220]

### Nets
GND: CV3.2 CV4.2 JP1.2 Q5.2(GND) ; supply symbol labelled SUP_GND ; also sheet 1,2,3,4,5,6,7
V5: CV4.1 Q5.3(VOUT) ; also sheet 1,2,3,4,5,6,7
VIN: CV3.1 JP1.1 Q5.1(VIN) ; also sheet 1,2,3,4,5,6,7

### Notes on the sheet
- Powersupply

## Library data of the parts
C1_1-C1_6 C1_M C2_1-C2_6 C2_M C3_1-C3_6 C3_M C4_1-C4_6 C4_M C5_1-C5_6 C5_M C6_1-C6_5 C7_1-C7_5 C8_1-C8_5 C9_1-C9_5 C10_1-C10_5 C11_1-C11_5 C12_1-C12_5 CV3 CV4 = Lib_Passive:C_CAP
C10 = SparkFun-Capacitors:CAP: Capacitor Standard 0603 ceramic capacitor, and 0.1" leaded capacitor.
E1-E5 = Lib_TH:J_MTA5P
H1-H5 = PCB0M1:Q_A3959: Full Bridge Peak Current mode controll driver
J6 MS MS1 S1-S5 = PCB0M1:J_MC32857: SWITCH, TACTILE, SPST-NO, 50mA, THD
JP1-JP6 JP9-JP13 = SparkFun-Connectors:M02: Standard 2-pin 0.1" header. Use with - straight break away headers ( PRT-00116) - right angle break away headers (PRT-00553) - swiss pins (PRT-00743) - machine pins (PRT-00117) - female headers (PRT-00115) Molex polarized connector foot print use with: PRT-08233 with associated crimp pins and housings. 2.54_SCREWTERM for use with PRT-10571. 3.5mm Screw Terminal footprints for PRT-08084 5mm Screw Terminal footprints for use with PRT-08433
JP7 JP8 O6 = SparkFun-Connectors:M04: Header 4 Standard 4-pin 0.1" header. Use with straight break away headers (SKU : PRT-00116), right angle break away headers (PRT-00553), swiss pins (PRT-00743), machine pins (PRT-00117), and female headers (PRT-00115). Molex polarized connector foot print use with SKU : PRT-08231 with associated crimp pins and housings. 1MM SMD Version SKU: PRT-10208
JP14 JP15 = SparkFun-Connectors:M03: Header 3 Standard 3-pin 0.1" header. Use with straight break away headers (SKU : PRT-00116), right angle break away headers (PRT-00553), swiss pins (PRT-00743), machine pins (PRT-00117), and female headers (PRT-00115). Molex polarized connector foot print use with SKU : PRT-08232 with associated crimp pins and housings.
LED1-LED18 LED21 = LilyPad-Wearables:LED: LEDs Standard schematic elements and footprints for 5mm, 3mm, 1206, and 0603 sized LEDs. 5mm - Spark Fun Electronics SKU : Comp-SBL
MD = Lib_TH:J_MTA3P
MP P1-P6 = PCB0M1:Q_ATMEGA328P: ATMEGA 328P in 28PIN PDIP package
MX X1-X6 = PCB0M1:X_HC49SCRYSTAL: CRYSTAL METAL CAN, 16MHZ, 18PF, HC-49/US
Q1 Q2 Q4 = SparkFun-DiscreteSemi:MOSFET-NCHANNEL: Common NMOSFET Parts MFG P/N Store ID Prod ID FDD8780 TRANS-09984 SI7820DN TRANS-11055 FDS6630A IC-08089 2N7002PW TRANS-11151 FQP30N06L COM-10213 TRANS-10060 BSS123LT1G TRANS-08345 BSS138 TRANS-00830 BS170 2N7000; PROD_ID: TRANS-10060
Q3 = PCB0M1:Q_LTC490: IC, RS422-RS485 DRVR
Q5 = PCB0M1:Q_LDO: LDO with fixed ouput voltage
R1 R2 R4 R5 R8-R32 = SparkFun-Passives:RESISTOR: Resistor Basic schematic elements and footprints for 0603, 1206, and PTH resistors.
R1_1-R1_6 R1_M R1_M1 R4_1-R4_5 R5_1-R5_5 R6_1-R6_5 R7_1-R7_5 R8_1-R8_5 R9_1-R9_5 = Lib_Passive:R_RES
R3 R6 R7 = SparkFun-Resistors:10KOHM1/6W5%(PTH): RES-08375; PROD_ID: RES-08375
SJ1 = SparkFun-Passives:SOLDERJUMPER: Solder Jumper Standard SMD solder jumper. Used to automate production. Two varients : Normally Open and Normally Closed are the same, but have different paste layers. NC will have a large amount of paste and should jumper during reflow.
U$2 = SparkFun-Connectors:RJ45-8: RJ45 Jack Simple RJ45, 8-pin connection - connector for common Cat5, Cat5e, and Cat6 Ethernet cables. Footprint not yet proven in production. Connector sku is PRT-00643; Breakout PCB sku is BOB-00716.
U$26 = SparkFun-DigitalIC:MAX485: RS-485 transceiver